# EAGLE design stm32_bob (EAGLE 7.3.0)
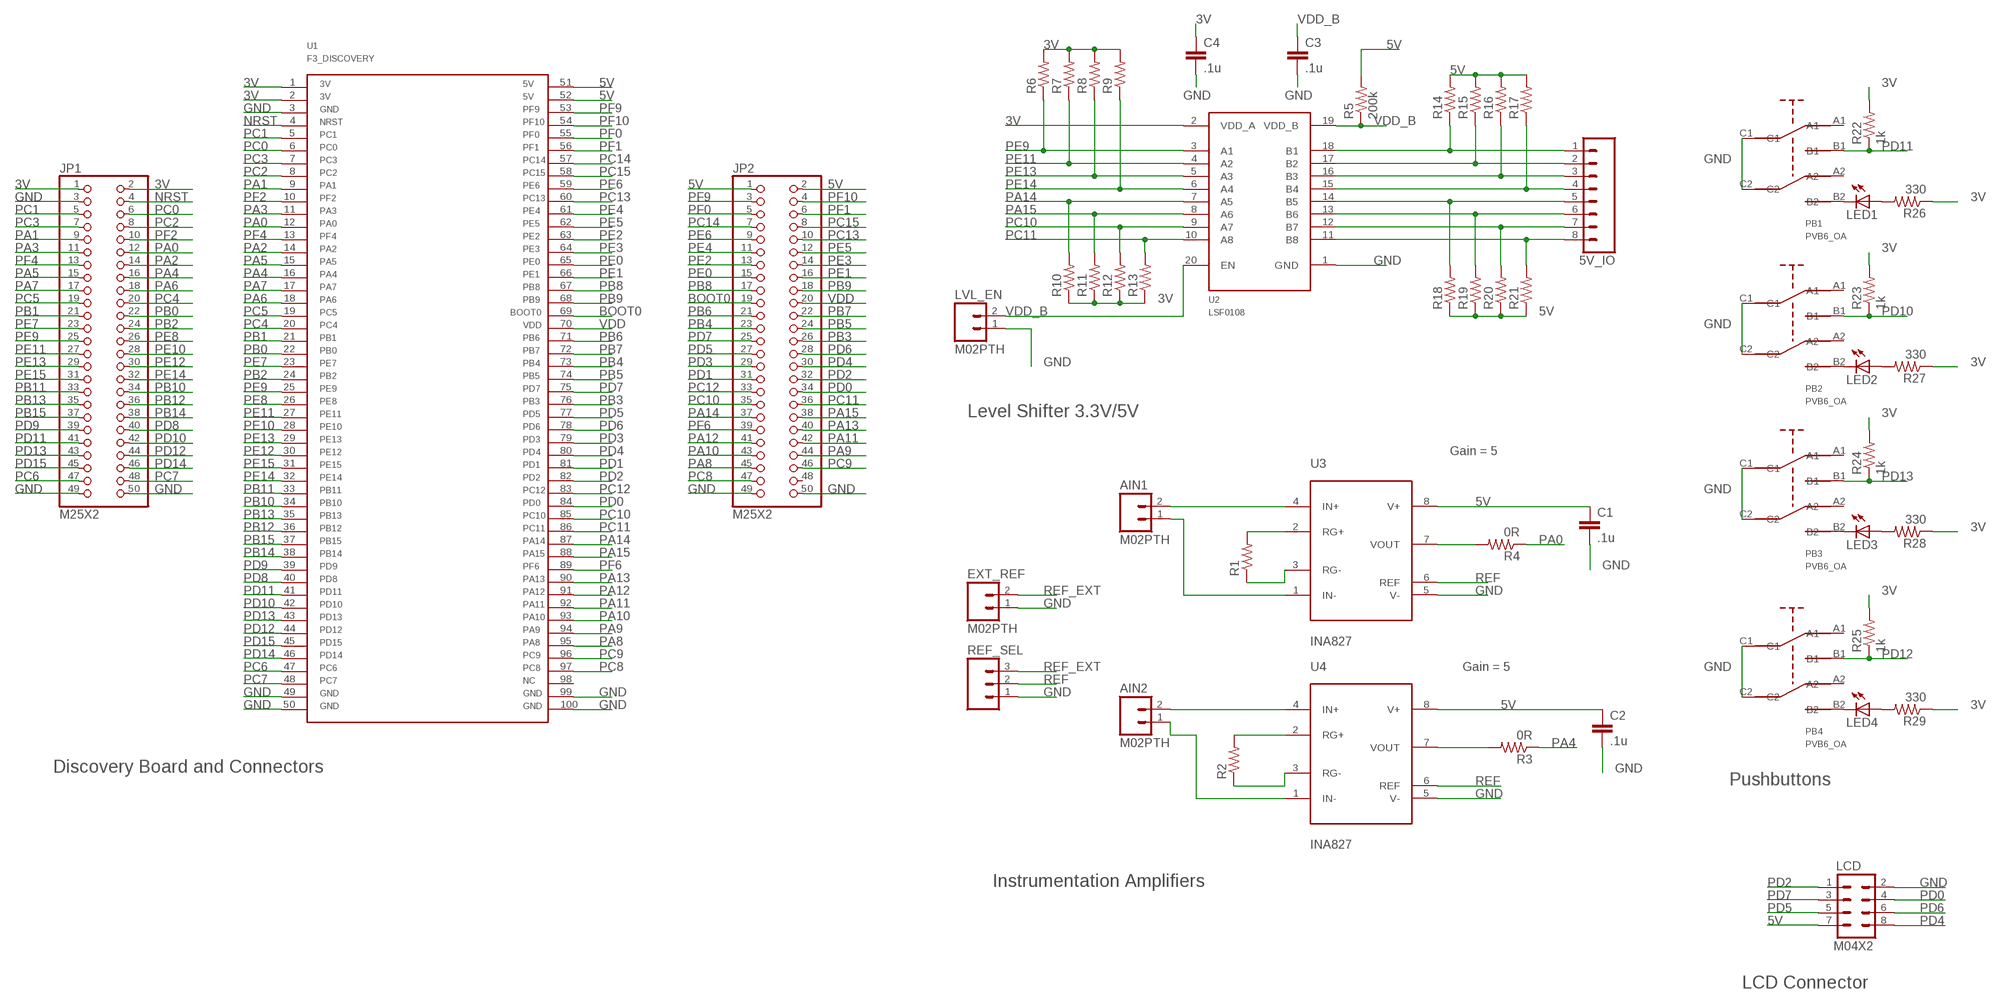
[diagram p0: schematic, sheet 1]

## Parts
5V_IO  M081X08  [1X08]
AIN1  M02PTH  [1X02]
AIN2  M02PTH  [1X02]
C1  .1u  C-EUC0805  [C0805]
C2  .1u  C-EUC0805  [C0805]
C3  .1u  C-EUC0805  [C0805]
C4  .1u  C-EUC0805  [C0805]
EXT_REF  M02PTH  [1X02]
JP1  M25X2  [2X25]
JP2  M25X2  [2X25]
LCD  M04X2  [2X4]
LED1  LED1206  [LED-1206]
LED2  LED1206  [LED-1206]
LED3  LED1206  [LED-1206]
LED4  LED1206  [LED-1206]
LVL_EN  M02PTH  [1X02]
PB1  PVB6_OA  [PVB6_OA]
PB2  PVB6_OA  [PVB6_OA]
PB3  PVB6_OA  [PVB6_OA]
PB4  PVB6_OA  [PVB6_OA]
R1  R-US_R1206  [R1206]
R2  R-US_R1206  [R1206]
R3  0R  R-US_R1206  [R1206]
R4  0R  R-US_R1206  [R1206]
R5  200k  R-US_R0805  [R0805]
R6  R-US_R0805  [R0805]
R7  R-US_R0805  [R0805]
R8  R-US_R0805  [R0805]
R9  R-US_R0805  [R0805]
R10  R-US_R0805  [R0805]
R11  R-US_R0805  [R0805]
R12  R-US_R0805  [R0805]
R13  R-US_R0805  [R0805]
R14  R-US_R0805  [R0805]
R15  R-US_R0805  [R0805]
R16  R-US_R0805  [R0805]
R17  R-US_R0805  [R0805]
R18  R-US_R0805  [R0805]
R19  R-US_R0805  [R0805]
R20  R-US_R0805  [R0805]
R21  R-US_R0805  [R0805]
R22  1k  R-US_R0805  [R0805]
R23  1k  R-US_R0805  [R0805]
R24  1k  R-US_R0805  [R0805]
R25  1k  R-US_R0805  [R0805]
R26  330  R-US_R0805  [R0805]
R27  330  R-US_R0805  [R0805]
R28  330  R-US_R0805  [R0805]
R29  330  R-US_R0805  [R0805]
REF_SEL  M03PTH  [1X03]
U1  F3_DISCOVERY  [F3_DISCOVERY]
U2  LSF0108  [LSF0108]
U3  INA827  [MSOP8]
U4  INA827  [MSOP8]

## Nets
3V: C4.1 JP1.1 JP1.2 R6.2 R7.2 R8.2 R9.2 R10.1 R11.1 R12.1 R13.1 R22.2 R23.2 R24.2 R25.2 R26.1 R27.1 R28.1 R29.1 U1.1 U1.2 U2.2(VDD_A)
5V: C1.1 C2.1 JP2.1 JP2.2 LCD.7 R5.2 R14.2 R15.2 R16.2 R17.2 R18.1 R19.1 R20.1 R21.1 U1.51 U1.52 U3.8(V+) U4.8(V+)
BOOT0: JP2.19 U1.69
GND: C1.2 C2.2 C3.2 C4.2 EXT_REF.1 JP1.3 JP1.49 JP1.50 JP2.49 JP2.50 LCD.2 LVL_EN.1 PB1.C1 PB1.C2 PB2.C1 PB2.C2 PB3.C1 PB3.C2 PB4.C1 PB4.C2 REF_SEL.1 U1.3 U1.49 U1.50 U1.99 U1.100 U2.1(GND) U3.5(V-) U4.5(V-)
N$1: 5V_IO.1 R14.1 U2.18(B1)
N$2: 5V_IO.2 R15.1 U2.17(B2)
N$3: 5V_IO.3 R16.1 U2.16(B3)
N$4: 5V_IO.4 R17.1 U2.15(B4)
N$5: 5V_IO.5 R18.2 U2.14(B5)
N$6: 5V_IO.6 R19.2 U2.13(B6)
N$7: 5V_IO.7 R20.2 U2.12(B7)
N$8: 5V_IO.8 R21.2 U2.11(B8)
N$9: AIN1.1 U3.1(IN-)
N$10: AIN1.2 U3.4(IN+)
N$11: AIN2.2 U4.4(IN+)
N$12: AIN2.1 U4.1(IN-)
N$13: R1.2 U3.2(RG+)
N$14: R1.1 U3.3(RG-)
N$15: R2.2 U4.2(RG+)
N$16: R2.1 U4.3(RG-)
N$17: R4.2 U3.7(VOUT)
N$18: R3.2 U4.7(VOUT)
N$19: LED1.C PB1.B2
N$20: LED2.C PB2.B2
N$21: LED3.C PB3.B2
N$22: LED4.C PB4.B2
N$23: LED1.A R26.2
N$24: LED2.A R27.2
N$25: LED3.A R28.2
N$26: LED4.A R29.2
NRST: JP1.4 U1.4
PA0: JP1.12 R4.1 U1.12
PA1: JP1.9 U1.9
PA2: JP1.14 U1.14
PA3: JP1.11 U1.11
PA4: JP1.16 R3.1 U1.16
PA5: JP1.15 U1.15
PA6: JP1.18 U1.18
PA7: JP1.17 U1.17
PA8: JP2.45 U1.95
PA9: JP2.44 U1.94
PA10: JP2.43 U1.93
PA11: JP2.42 U1.92
PA12: JP2.41 U1.91
PA13: JP2.40 U1.90
PA14: JP2.37 R10.2 U1.87 U2.7(A5)
PA15: JP2.38 R11.2 U1.88 U2.8(A6)
PB0: JP1.22 U1.22
PB1: JP1.21 U1.21
PB2: JP1.24 U1.24
PB3: JP2.26 U1.76
PB4: JP2.23 U1.73
PB5: JP2.24 U1.74
PB6: JP2.21 U1.71
PB7: JP2.22 U1.72
PB8: JP2.17 U1.67
PB9: JP2.18 U1.68
PB10: JP1.34 U1.34
PB11: JP1.33 U1.33
PB12: JP1.36 U1.36
PB13: JP1.35 U1.35
PB14: JP1.38 U1.38
PB15: JP1.37 U1.37
PC0: JP1.6 U1.6
PC1: JP1.5 U1.5
PC2: JP1.8 U1.8
PC3: JP1.7 U1.7
PC4: JP1.20 U1.20
PC5: JP1.19 U1.19
PC6: JP1.47 U1.47
PC7: JP1.48 U1.48
PC8: JP2.47 U1.97
PC9: JP2.46 U1.96
PC10: JP2.35 R12.2 U1.85 U2.9(A7)
PC11: JP2.36 R13.2 U1.86 U2.10(A8)
PC12: JP2.33 U1.83
PC13: JP2.10 U1.60
PC14: JP2.7 U1.57
PC15: JP2.8 U1.58
PD0: JP2.34 LCD.4 U1.84
PD1: JP2.31 U1.81
PD2: JP2.32 LCD.1 U1.82
PD3: JP2.29 U1.79
PD4: JP2.30 LCD.8 U1.80
PD5: JP2.27 LCD.5 U1.77
PD6: JP2.28 LCD.6 U1.78
PD7: JP2.25 LCD.3 U1.75
PD8: JP1.40 U1.40
PD9: JP1.39 U1.39
PD10: JP1.42 PB2.B1 R23.1 U1.42
PD11: JP1.41 PB1.B1 R22.1 U1.41
PD12: JP1.44 PB4.B1 R25.1 U1.44
PD13: JP1.43 PB3.B1 R24.1 U1.43
PD14: JP1.46 U1.46
PD15: JP1.45 U1.45
PE0: JP2.15 U1.65
PE1: JP2.16 U1.66
PE2: JP2.13 U1.63
PE3: JP2.14 U1.64
PE4: JP2.11 U1.61
PE5: JP2.12 U1.62
PE6: JP2.9 U1.59
PE7: JP1.23 U1.23
PE8: JP1.26 U1.26
PE9: JP1.25 R6.1 U1.25 U2.3(A1)
PE10: JP1.28 U1.28
PE11: JP1.27 R7.1 U1.27 U2.4(A2)
PE12: JP1.30 U1.30
PE13: JP1.29 R8.1 U1.29 U2.5(A3)
PE14: JP1.32 R9.1 U1.32 U2.6(A4)
PE15: JP1.31 U1.31
PF0: JP2.5 U1.55
PF1: JP2.6 U1.56
PF2: JP1.10 U1.10
PF4: JP1.13 U1.13
PF6: JP2.39 U1.89
PF9: JP2.3 U1.53
PF10: JP2.4 U1.54
REF: REF_SEL.2 U3.6(REF) U4.6(REF)
REF_EXT: EXT_REF.2 REF_SEL.3
VDD: JP2.20 U1.70
VDD_B: C3.1 LVL_EN.2 R5.1 U2.19(VDD_B) U2.20(EN)
Unconnected: JP2.48 PB1.A1 PB1.A2 PB2.A1 PB2.A2 PB3.A1 PB3.A2 PB4.A1 PB4.A2 U1.98

## Notes on the sheet
- Level Shifter 3.3V/5V
- Gain = 5
- Gain = 5
- Discovery Board and Connectors
- Pushbuttons
- Instrumentation Amplifiers
- LCD Connector

## Library data of the parts
5V_IO = SparkFun-Connectors:M08: Header 8 Standard 8-pin 0.1" header. Use with straight break away headers (SKU : PRT-00116), right angle break away headers (PRT-00553), swiss pins (PRT-00743), machine pins (PRT-00117), and female headers (PRT-00115).
AIN1 AIN2 EXT_REF LVL_EN = SparkFun-Connectors:M02: Standard 2-pin 0.1" header. Use with - straight break away headers ( PRT-00116) - right angle break away headers (PRT-00553) - swiss pins (PRT-00743) - machine pins (PRT-00117) - female headers (PRT-00115) Molex polarized connector foot print use with: PRT-08233 with associated crimp pins and housings. 2.54_SCREWTERM for use with PRT-10571. 3.5mm Screw Terminal footprints for PRT-08084 5mm Screw Terminal footprints for use with PRT-08433
C1-C4 = rcl:C-EU: CAPACITOR, European symbol
JP1 JP2 = SparkFun-Connectors:M25X2
LCD = SparkFun-Connectors:M04X2: .1" header, two rows of four.
LED1-LED4 = SparkFun-LED:LED: LEDs Standard schematic elements and footprints for 5mm, 3mm, 1206, and 0603 sized LEDs. 5mm - Spark Fun Electronics SKU : COM-00529 (and others)
PB1-PB4 = green-electronics:PVB6_OA
R1-R29 = rcl:R-US_: RESISTOR, American symbol
REF_SEL = SparkFun-Connectors:M03: Header 3 Standard 3-pin 0.1" header. Use with straight break away headers (SKU : PRT-00116), right angle break away headers (PRT-00553), swiss pins (PRT-00743), machine pins (PRT-00117), and female headers (PRT-00115). Molex polarized connector foot print use with SKU : PRT-08232 with associated crimp pins and housings.
U1 = green-electronics:F3_DISCOVERY
U2 = green-electronics:LSF0108
U3 U4 = littlebox:INA827

## Board
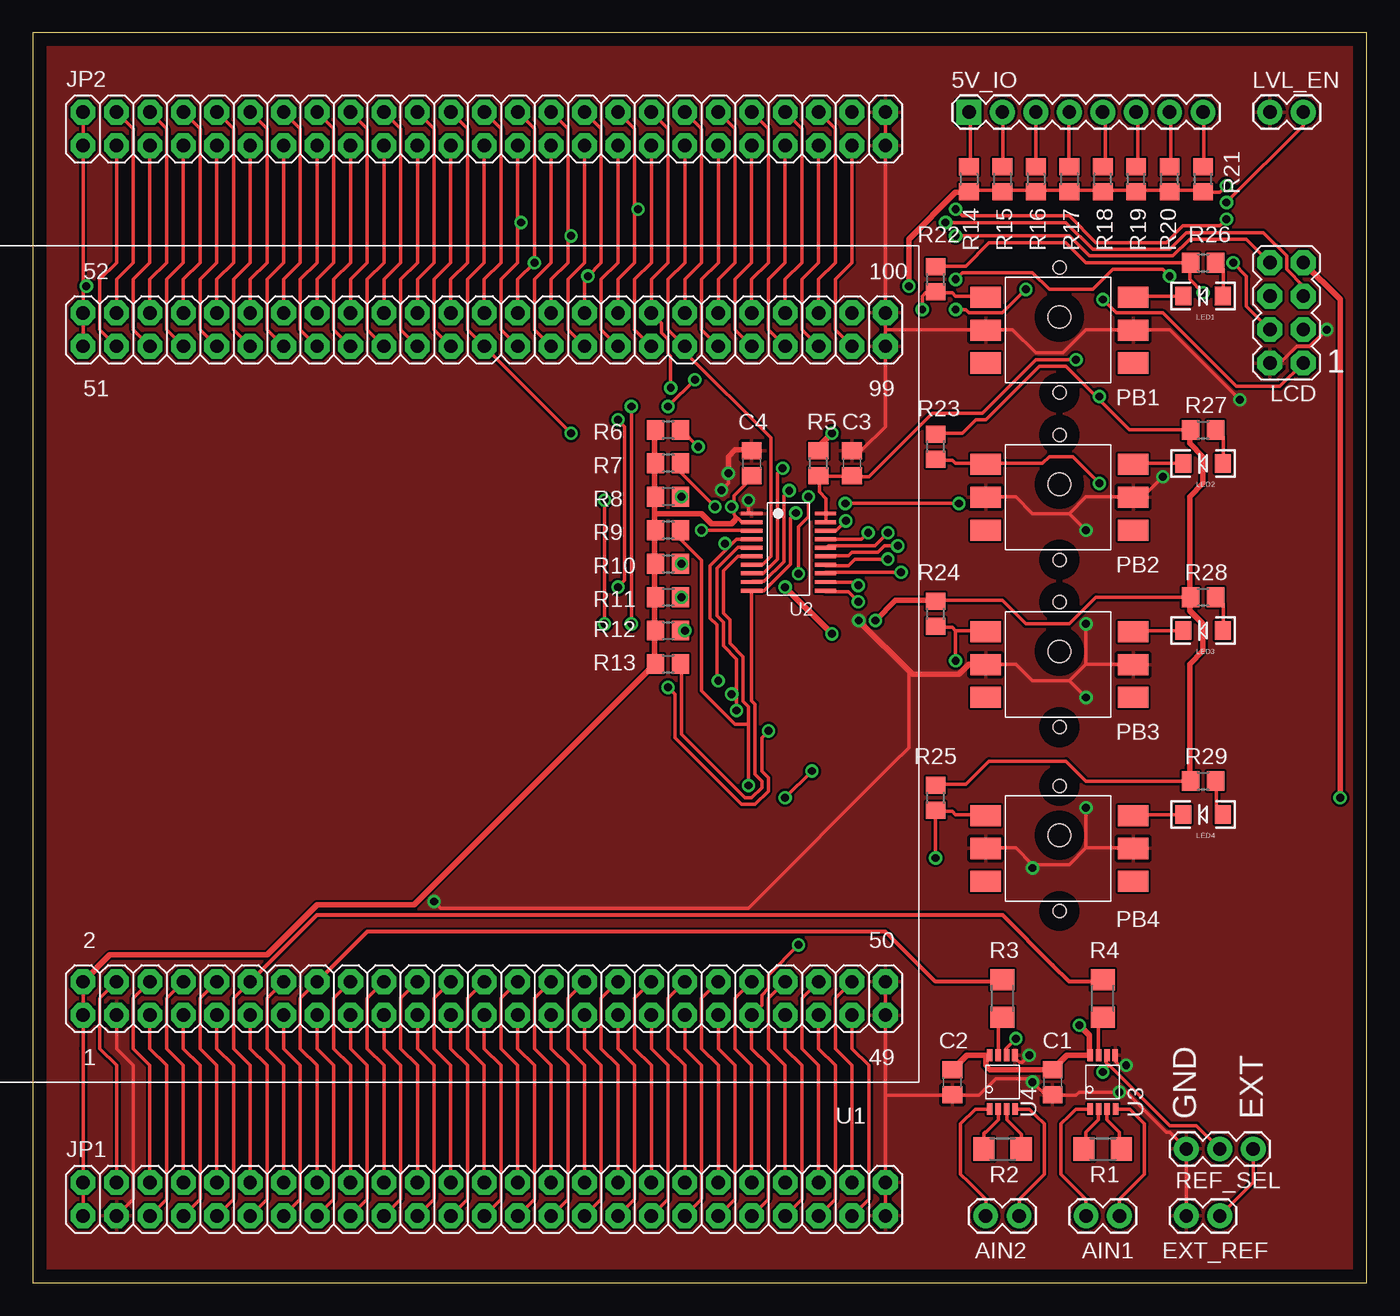
[diagram p1: board, top side]
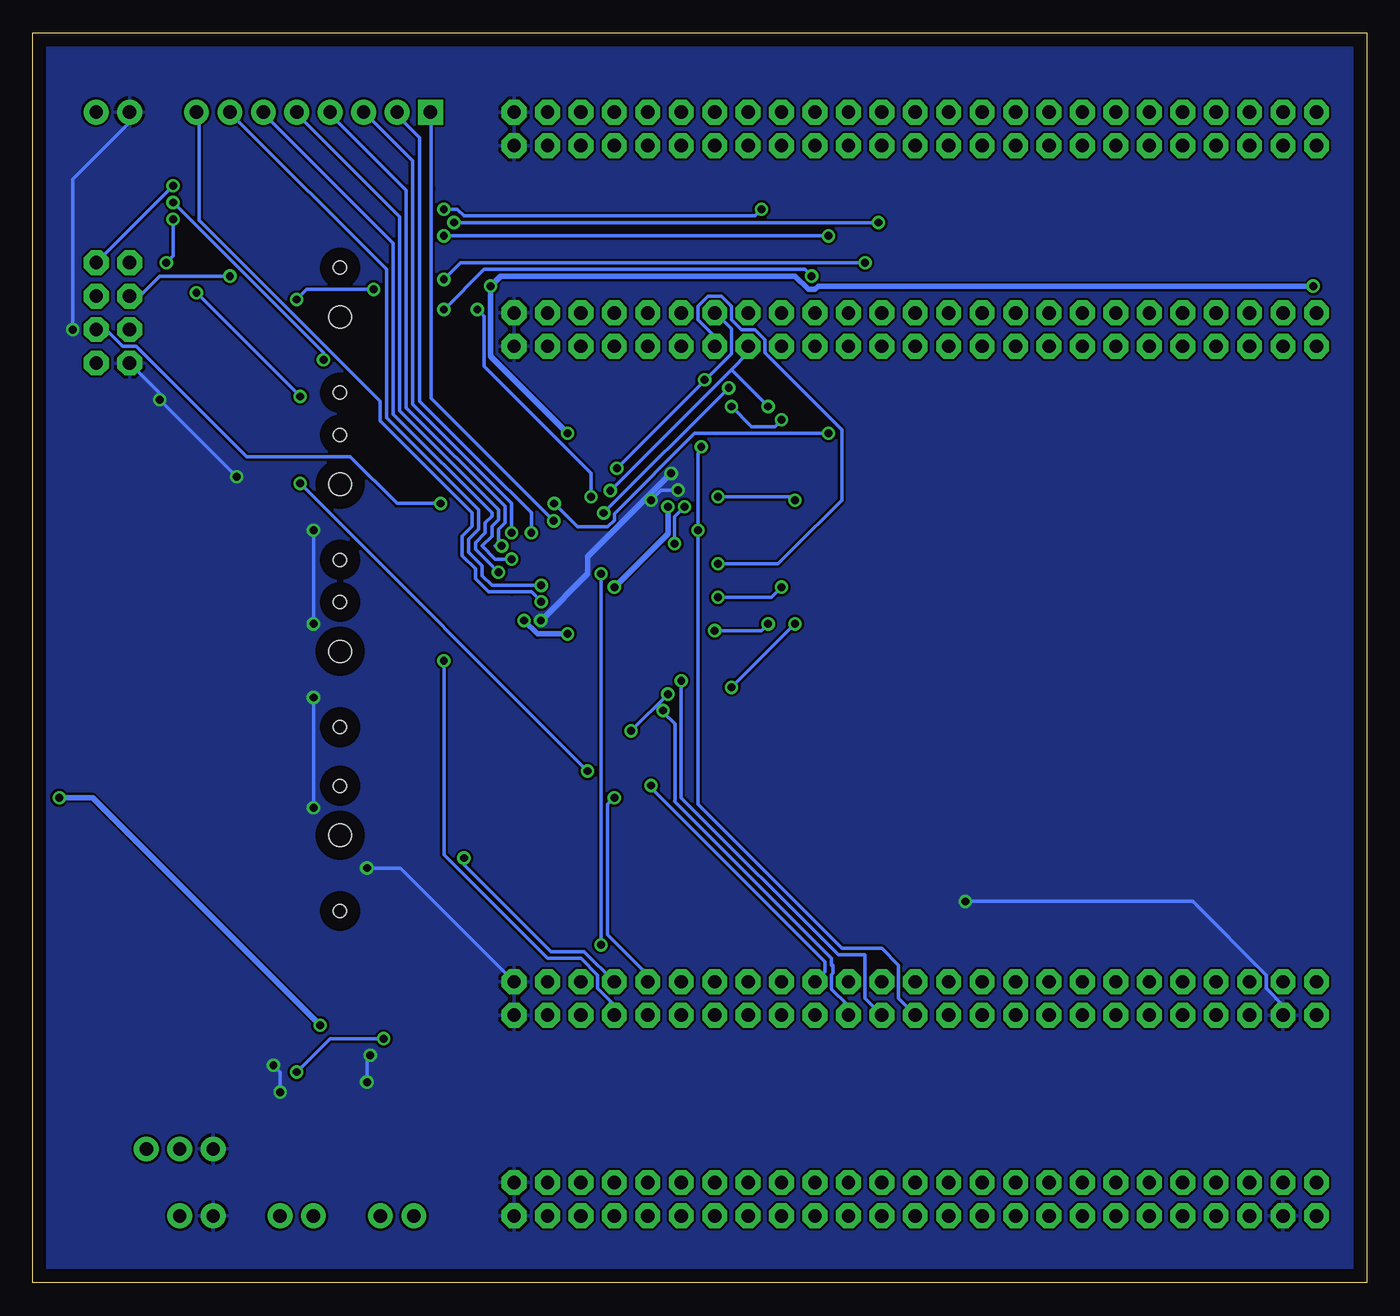
[diagram p2: board, bottom side, seen from below]

Size 101.33 x 94.92 mm. Coordinates in mm from the lower left corner, seen from the top.
Outline: 0,0 101.33,0 101.33,94.92 0,94.92 0,0
Copper layers (1*16): Top 0.035mm / dielectric 1.5mm / Bottom 0.035mm
Design rules "default *": minimum track width 10mil, minimum drill 10mil, track to track 7mil, track to pad 7mil, pad to pad 7mil, via to via 7mil, smd to smd 0mil, copper to edge 40mil, drill to drill 8mil, minimum pad ring 10mil, minimum via ring 8mil, stop-mask expansion 4mil, vias tented up to drill 0mil, thermal gap 10mil

### Footprints (pad centres in the part's own frame; a part is rotated, then mirrored left to right if it is on the bottom)
1X08 = drill 1.016 pad 1.88 square: 1 0,0 | drill 1.016 pad 1.88: 2 2.54,0; 3 5.08,0; 4 7.62,0; 5 10.16,0; 6 12.7,0; 7 15.24,0; 8 17.78,0
1X02 = drill 1.016 pad 1.88: 1 0,0; 2 2.54,0
C0805 = smd 1.3 x 1.5: 1 -0.95,0; 2 0.95,0
2X25 = drill 1.016 pad 1.88 octagon: 1 0,0; 2 0,2.54; 3 2.54,0; 4 2.54,2.54; 5 5.08,0; 6 5.08,2.54; 7 7.62,0; 8 7.62,2.54; 9 10.16,0; 10 10.16,2.54; 11 12.7,0; 12 12.7,2.54; 13 15.24,0; 14 15.24,2.54; 15 17.78,0; 16 17.78,2.54; 17 20.32,0; 18 20.32,2.54; 19 22.86,0; 20 22.86,2.54; 21 25.4,0; 22 25.4,2.54; 23 27.94,0; 24 27.94,2.54; 25 30.48,0; 26 30.48,2.54; 27 33.02,0; 28 33.02,2.54; 29 35.56,0; 30 35.56,2.54; 31 38.1,0; 32 38.1,2.54; 33 40.64,0; 34 40.64,2.54; 35 43.18,0; 36 43.18,2.54; 37 45.72,0; 38 45.72,2.54; 39 48.26,0; 40 48.26,2.54; 41 50.8,0; 42 50.8,2.54; 43 53.34,0; 44 53.34,2.54; 45 55.88,0; 46 55.88,2.54; 47 58.42,0; 48 58.42,2.54; 49 60.96,0; 50 60.96,2.54
2X4 = drill 1.016 pad 1.88 octagon: 1 -3.81,-1.27; 2 -3.81,1.27; 3 -1.27,-1.27; 4 -1.27,1.27; 5 1.27,-1.27; 6 1.27,1.27; 7 3.81,-1.27; 8 3.81,1.27
LED-1206 = smd 1.2 x 1.4: A -1.5,0; C 1.5,0
PVB6_OA = smd 2.3 x 1.6: A1 0,0; A2 11.2,0; B1 0,5; B2 11.2,5; C1 0,2.5; C2 11.2,2.5 | hole 1: 5.6,7.25; 5.6,-2.25 | hole 1.7: 5.6,3.5
R1206 = smd 1.6 x 1.803: 1 -1.422,0; 2 1.422,0
R0805 = smd 1.3 x 1.5: 1 -0.95,0; 2 0.95,0
1X03 = drill 1.016 pad 1.88: 1 0,0; 2 2.54,0; 3 5.08,0
F3_DISCOVERY = drill 1.016 pad 1.88 octagon: 1 0,0; 2 0,2.54; 3 2.54,0; 4 2.54,2.54; 5 5.08,0; 6 5.08,2.54; 7 7.62,0; 8 7.62,2.54; 9 10.16,0; 10 10.16,2.54; 11 12.7,0; 12 12.7,2.54; 13 15.24,0; 14 15.24,2.54; 15 17.78,0; 16 17.78,2.54; 17 20.32,0; 18 20.32,2.54; 19 22.86,0; 20 22.86,2.54; 21 25.4,0; 22 25.4,2.54; 23 27.94,0; 24 27.94,2.54; 25 30.48,0; 26 30.48,2.54; 27 33.02,0; 28 33.02,2.54; 29 35.56,0; 30 35.56,2.54; 31 38.1,0; 32 38.1,2.54; 33 40.64,0; 34 40.64,2.54; 35 43.18,0; 36 43.18,2.54; 37 45.72,0; 38 45.72,2.54; 39 48.26,0; 40 48.26,2.54; 41 50.8,0; 42 50.8,2.54; 43 53.34,0; 44 53.34,2.54; 45 55.88,0; 46 55.88,2.54; 47 58.42,0; 48 58.42,2.54; 49 60.96,0; 50 60.96,2.54; 51 0,50.8; 52 0,53.34; 53 2.54,50.8; 54 2.54,53.34; 55 5.08,50.8; 56 5.08,53.34; 57 7.62,50.8; 58 7.62,53.34; 59 10.16,50.8; 60 10.16,53.34; 61 12.7,50.8; 62 12.7,53.34; 63 15.24,50.8; 64 15.24,53.34; 65 17.78,50.8; 66 17.78,53.34; 67 20.32,50.8; 68 20.32,53.34; 69 22.86,50.8; 70 22.86,53.34; 71 25.4,50.8; 72 25.4,53.34; 73 27.94,50.8; 74 27.94,53.34; 75 30.48,50.8; 76 30.48,53.34; 77 33.02,50.8; 78 33.02,53.34; 79 35.56,50.8; 80 35.56,53.34; 81 38.1,50.8; 82 38.1,53.34; 83 40.64,50.8; 84 40.64,53.34; 85 43.18,50.8; 86 43.18,53.34; 87 45.72,50.8; 88 45.72,53.34; 89 48.26,50.8; 90 48.26,53.34; 91 50.8,50.8; 92 50.8,53.34; 93 53.34,50.8; 94 53.34,53.34; 95 55.88,50.8; 96 55.88,53.34; 97 58.42,50.8; 98 58.42,53.34; 99 60.96,50.8; 100 60.96,53.34
LSF0108 = smd 0.3 x 1.6: 1 0,0; 2 0.65,0; 3 1.3,0; 4 1.95,0; 5 2.6,0; 6 3.25,0; 7 3.9,0; 8 4.55,0; 9 5.2,0; 10 5.85,0; 11 5.85,5.6; 12 5.2,5.6; 13 4.55,5.6; 14 3.9,5.6; 15 3.25,5.6; 16 2.6,5.6; 17 1.95,5.6; 18 1.3,5.6; 19 0.65,5.6; 20 0,5.6
MSOP8 = smd 0.9 x 0.42: 1 -2.05,0.975; 2 -2.05,0.325; 3 -2.05,-0.325; 4 -2.05,-0.975; 5 2.05,-0.945; 6 2.05,-0.325; 7 2.05,0.325; 8 2.05,0.975

### Placement (x,y rotation side)
5V_IO  71.12,88.9 0 top
AIN1  80.01,5.08 0 top
AIN2  72.39,5.08 0 top
C1  77.47,15.24 270 top
C2  69.85,15.24 270 top
C3  62.23,62.23 90 top
C4  54.61,62.23 90 top
EXT_REF  87.63,5.08 0 top
JP1  3.81,5.08 0 top
JP2  3.81,86.36 0 top
LCD  95.25,73.66 90 top
LED1  88.9,74.93 180 top
LED2  88.9,62.23 180 top
LED3  88.9,49.53 180 top
LED4  88.9,35.56 180 top
LVL_EN  93.98,88.9 0 top
PB1  72.39,69.85 0 top
PB2  72.39,57.15 0 top
PB3  72.39,44.45 0 top
PB4  72.39,30.48 0 top
R1  81.28,10.16 180 top
R2  73.66,10.16 180 top
R3  73.66,21.59 270 top
R4  81.28,21.59 270 top
R5  59.69,62.23 90 top
R6  48.26,64.77 180 top
R7  48.26,62.23 180 top
R8  48.26,59.69 180 top
R9  48.26,57.15 180 top
R10  48.26,54.61 0 top
R11  48.26,52.07 0 top
R12  48.26,49.53 0 top
R13  48.26,46.99 0 top
R14  71.12,83.82 270 top
R15  73.66,83.82 270 top
R16  76.2,83.82 270 top
R17  78.74,83.82 270 top
R18  81.28,83.82 90 top
R19  83.82,83.82 90 top
R20  86.36,83.82 90 top
R21  88.9,83.82 90 top
R22  68.58,76.2 90 top
R23  68.58,63.5 90 top
R24  68.58,50.8 90 top
R25  68.58,36.83 90 top
R26  88.9,77.47 0 top
R27  88.9,64.77 0 top
R28  88.9,52.07 0 top
R29  88.9,38.1 0 top
REF_SEL  87.63,10.16 0 top
U1  3.81,20.32 0 top
U2  54.61,58.42 270 top
U3  81.28,15.24 90 top
U4  73.66,15.24 90 top

### Tracks (layer width: path | path; a pad name or v marks a point on that pad's centre or on a via)
3V  (via drill 0.6)
  Top 0.254: U1.2 U1.1 3.81,17.78 JP1.2 JP1.1 | 53.4,58.22 53.26,58.36 53.26,58.93 53.26,59.76 54.76,61.26 54.66,61.36 C4.1 | 53.4,58.22 53.65,57.97 53.86,57.76 54.56,57.76 U2.2 | 87.88,77.47 80.01,77.47 78.49,78.99 72.64,78.99 70.87,77.22 68.58,77.22 R22.2 | 87.88,77.47 R26.1 87.88,77.47 | 80.77,67.31 78.49,69.6 76.45,69.6 72.39,65.53 71.63,65.53 70.61,64.52 68.58,64.52 R23.2 | 80.77,67.31 83.31,64.77 87.88,64.77 R27.1 | R28.1 87.88,52.07 80.77,52.07 78.74,50.04 75.44,50.04 73.66,51.82 68.58,51.82 R24.2 | R29.1 87.88,38.1 80.01,38.1 78.49,39.62 72.64,39.62 70.87,37.85 68.58,37.85 R25.2 | 53.34,57.91 53.34,58.17 53.4,58.22 | v81.03,67.31 80.77,67.31 | v88.9,75.18 87.88,76.2 87.88,77.47
  Top 0.406: U1.2 5.84,24.89 17.78,24.89 21.59,28.7 26.42,28.7 28.96,28.7 47.24,46.99 | 47.24,46.99 R13.1 | 47.24,46.99 47.24,49.53 | 47.24,49.53 R12.1 47.24,49.53 | 47.24,46.99 R13.1 | 47.24,49.53 47.24,52.07 | 47.24,52.07 R11.1 47.24,52.07 | 47.24,52.07 47.24,54.61 | 47.24,54.61 R10.1 47.24,54.61 | 47.24,54.61 47.24,57.15 | 47.24,57.15 R9.2 47.24,57.15 | 47.24,57.15 47.24,58.42 | 47.24,58.42 47.24,59.69 | 47.24,59.69 R8.2 47.24,59.69 | 47.24,59.69 47.24,62.23 | 47.24,62.23 R7.2 47.24,62.23 | 47.24,62.23 47.24,64.77 R6.2 | 53.34,57.91 53.09,57.66 51.56,57.66 50.8,58.42 47.24,58.42 | 87.88,52.07 87.88,59.69 88.9,60.71 88.9,62.74 87.88,63.75 87.88,64.77 R27.1 | 87.88,52.07 R28.1 87.88,52.07 | 87.88,52.07 87.88,51.05 88.9,50.04 88.9,48.01 87.88,46.99 87.88,39.12 87.88,38.1 R29.1 | v64.01,50.29 65.53,51.82 68.58,51.82 R24.2 | v57.15,52.83 v60.71,49.28 | 53.26,58.93 53.34,58.93 53.26,58.93 | 53.26,58.93 v53.09,58.93 | 47.24,46.99 R13.1
  Bottom 0.254: v88.9,75.18 v81.03,67.31
  Bottom 0.406: v64.01,50.29 62.99,49.28 v60.71,49.28 | v57.15,52.83 53.09,56.9 v53.09,58.93
5V  (via drill 0.6)
  Top 0.254: U1.51 U1.52 3.81,75.69 JP2.1 JP2.2 | R14.2 71.21,82.96 73.46,82.96 R15.2 73.71,82.96 75.96,82.96 R16.2 76.21,82.96 78.71,82.96 R17.2 78.96,82.96 81.21,82.96 R18.1 81.46,82.96 83.71,82.96 R19.1 83.96,82.96 86.21,82.96 R20.1 86.46,82.96 88.71,82.96 R21.1 88.9,82.8 90.17,82.8 v90.68,83.31
  Top 0.406: C2.1 70.95,17.29 U4.8 72.39,17 72.39,16.51 72.71,16.19 C1.1 78.57,17.29 U3.8 80.26,17.53 80.26,18.8 v79.5,19.56 | v66.55,75.69 66.55,79.25 70.1,82.8 71.12,82.8 R14.2 | v60.71,64.52 59.44,63.25 59.69,62.99 R5.2 | v4.06,75.69 3.81,75.69 | v99.31,36.83 99.31,74.68 LCD.7
  Bottom 0.254: LCD.7 v90.68,83.31
  Bottom 0.406: v60.71,64.52 66.55,70.36 v66.55,75.69 65.79,76.45 43.43,76.45 42.42,75.44 41.91,75.44 41.66,75.69 v4.06,75.69 | v99.31,36.83 96.77,36.83 v79.5,19.56
BOOT0
  Top 0.254: JP2.19 26.67,77.47 25.4,76.2 25.4,72.39 U1.69
GND  (via drill 0.6)
  Top 0.254: U1.3 6.35,17.78 7.62,16.51 7.62,6.35 JP1.3 | U1.50 64.77,21.59 U1.49 64.77,19.05 64.77,14.22 | 64.77,14.22 JP1.50 JP1.49 | JP2.50 JP2.49 U1.100 64.77,72.39 | 64.77,72.39 U1.99 64.77,65.02 62.99,63.25 62.23,63.25 C3.2 | 80.01,33.02 83.57,33.02 PB4.C2 | 80.01,33.02 78.74,31.75 75.95,31.75 | 75.95,31.75 74.68,33.02 72.39,33.02 PB4.C1 | 80.01,46.99 83.57,46.99 PB3.C2 | 78.74,45.72 80.01,46.99 | 78.74,45.72 75.95,45.72 74.68,46.99 72.39,46.99 PB3.C1 | 78.74,58.42 80.01,59.69 83.57,59.69 PB2.C2 83.82,59.69 84.33,59.69 v85.85,61.21 | 78.74,58.42 75.95,58.42 74.68,59.69 72.39,59.69 PB2.C1 | 72.39,72.39 74.42,72.39 76.2,70.61 78.23,70.61 80.01,72.39 83.57,72.39 PB1.C2 83.82,72.39 86.36,72.39 v91.69,67.06 | 72.39,72.39 PB1.C1 72.39,72.39 | EXT_REF.1 REF_SEL.1 86.36,11.43 86.11,11.43 83.06,14.48 v82.55,14.48 79.5,14.48 79.25,14.22 77.47,14.22 | 77.47,14.22 C1.2 77.47,14.22 | 77.47,14.22 76.96,14.22 v75.95,15.24 75.69,15.49 73.15,15.49 71.88,14.22 69.85,14.22 | v75.69,17.27 75.18,16.76 74.93,16.76 74.68,17.02 74.68,17.27 U4.5 | v83.06,16.51 82.55,16.51 82.3,16.76 82.3,17.27 U3.5 | 69.85,14.22 C2.2 69.85,14.22 | 69.85,14.22 64.77,14.22 | LCD.2 94.74,69.85 96.01,71.12 97.03,71.12 v98.3,72.39 | 72.39,72.39 64.77,72.39 | v80.01,50.04 80.01,46.99 | 78.74,58.42 v80.01,57.15 | v80.01,36.07 80.01,33.02 | 78.74,45.72 v80.01,44.45 | v75.95,31.5 75.95,31.75 | v30.48,28.96 30.99,28.45 51.82,28.45 54.36,28.45 65.28,39.37 66.55,40.64 66.55,46.23 66.67,46.35 | v52.83,61.47 52.83,60.71 v52.32,60.2 | v54.36,59.44 54.36,58.42 U2.1
  Top 0.406: v62.74,50.29 66.67,46.35 66.8,46.23 70.36,46.23 71.12,46.99 72.39,46.99 PB3.C1 | v52.83,61.47 52.83,62.74 53.34,63.25 54.61,63.25 C4.2
  Bottom 0.254: v75.95,15.24 75.95,17.02 v75.69,17.27 | v82.55,14.48 82.55,16 v83.06,16.51 | LCD.2 91.69,67.56 v91.69,67.06 v85.85,61.21 | v98.3,72.39 98.3,83.82 93.98,88.14 LVL_EN.1 | v80.01,57.15 v80.01,50.04 | v80.01,44.45 v80.01,36.07 | v30.48,28.96 13.21,28.96 7.62,23.37 7.62,22.35 6.35,21.08 U1.3 | v52.32,60.2 53.59,60.2 v54.36,59.44 | v75.95,31.5 73.41,31.5 U1.50
  Bottom 0.406: v62.74,50.29 59.18,53.85 59.18,55.12 v52.83,61.47
  pour Top: 101.6,94.74 101.6,-0.25 0,-0.25 0.25,94.74
  pour Bottom: 0.25,95.25 101.85,95.25 101.85,0.25 0.25,0.25
N$1  (via drill 0.6)
  Top 0.254: v61.76,57.86 61.06,57.16 60.26,57.16 U2.18 | 5V_IO.1 71.21,88.71 71.21,84.96 R14.1
  Bottom 0.254: v61.76,57.86 71.06,67.16 71.06,83.06 71.06,83.16 71.06,88.86 5V_IO.1
N$2  (via drill 0.6)
  Top 0.254: v63.46,56.96 62.96,56.46 60.46,56.46 U2.17 | 5V_IO.2 73.71,88.71 73.71,84.96 R15.1
  Bottom 0.254: v63.46,56.96 63.46,58.46 66.96,61.96 71.96,66.96 71.96,86.96 73.46,88.46 5V_IO.2
N$3  (via drill 0.6)
  Top 0.254: v64.96,56.96 63.96,55.96 60.46,55.96 U2.16 | 5V_IO.3 76.21,88.71 76.21,84.96 R16.1
  Bottom 0.254: v64.96,56.96 64.96,58.96 64.96,59.21 72.46,66.71 72.46,85.21 75.96,88.71 5V_IO.3
N$4  (via drill 0.6)
  Top 0.254: v65.71,55.96 64.71,55.96 64.21,55.46 62.21,55.46 61.96,55.21 60.21,55.21 U2.15 | 5V_IO.4 78.71,88.71 78.71,84.96 R17.1
  Bottom 0.254: 65.96,55.96 v65.71,55.96 65.96,55.96 | 65.96,55.96 66.21,55.96 | 65.96,55.96 65.96,57.21 65.46,57.71 65.46,58.96 72.96,66.46 72.96,82.96 78.71,88.71 5V_IO.4
N$5  (via drill 0.6)
  Top 0.254: v64.96,54.96 62.46,54.96 61.96,54.46 60.21,54.46 U2.14 | 5V_IO.5 81.46,88.71 81.46,84.96 R18.2
  Bottom 0.254: v64.96,54.96 66.21,54.96 67.21,55.96 66.46,56.71 66.46,57.46 65.96,57.96 65.96,58.71 73.46,66.21 73.46,80.96 81.21,88.71 5V_IO.5
N$6  (via drill 0.6)
  Top 0.254: v65.96,53.96 60.21,53.96 U2.13 | 5V_IO.6 83.96,88.71 83.96,84.96 R19.2
  Bottom 0.254: v65.96,53.96 67.71,55.71 67.71,56.21 66.96,56.96 66.96,57.71 66.46,58.21 66.46,58.46 73.96,65.96 73.96,78.96 83.71,88.71 5V_IO.6
N$7  (via drill 0.6)
  Top 0.254: v62.71,52.96 62.46,53.21 U2.12 | 5V_IO.7 86.46,88.71 86.46,84.96 R20.2
  Bottom 0.254: v62.71,52.96 66.46,52.96 67.21,53.71 67.21,54.46 68.21,55.46 68.21,56.46 67.46,57.21 67.46,58.71 74.46,65.71 74.46,76.96 86.21,88.71 5V_IO.7
N$8  (via drill 0.6)
  Top 0.254: v62.71,51.71 61.96,52.46 60.21,52.46 U2.11 | 5V_IO.8 88.96,88.71 88.96,84.96 R21.2
  Bottom 0.254: v62.71,51.71 63.46,52.46 64.96,52.46 66.71,52.46 67.71,53.46 67.71,54.21 68.71,55.21 68.71,56.71 67.96,57.46 67.96,58.46 74.96,65.46 74.96,66.96 88.71,80.71 88.71,88.71 5V_IO.8
N$9
  Top 0.254: U3.1 79.23,13.19 78.74,12.7 78.11,12.06 78.11,8.26 80.01,6.35 AIN1.1
N$10
  Top 0.254: AIN1.2 82.55,6.35 84.45,8.26 84.45,12.06 83.33,13.19 U3.4
N$11
  Top 0.254: AIN2.2 74.93,6.35 76.83,8.26 76.83,12.06 76.2,12.7 75.71,13.19 U4.4
N$12
  Top 0.254: U4.1 71.61,13.19 70.48,12.06 70.48,8.26 71.12,7.62 72.39,6.35 AIN2.1
N$13
  Top 0.254: R1.2 80.01,10.31 80.01,11.43 80.95,12.38 U3.2
N$14
  Top 0.254: R1.1 82.55,10.31 82.55,11.43 81.61,12.38 U3.3
N$15
  Top 0.254: R2.2 72.24,11.28 arc-90 72.39,11.43 73.33,12.38 U4.2
N$16
  Top 0.254: R2.1 75.08,11.28 74.93,11.43 73.98,12.38 U4.3
N$17
  Top 0.254: U3.7 80.95,19.84 R4.2
N$18
  Top 0.254: U4.7 73.33,19.84 R3.2
N$19
  Top 0.254: LED1.C 87.38,74.93 83.82,74.93 PB1.B2
N$20
  Top 0.254: LED2.C 87.38,62.23 83.82,62.23 PB2.B2
N$21
  Top 0.254: LED3.C 87.38,49.53 83.82,49.53 PB3.B2
N$22
  Top 0.254: LED4.C 87.38,35.56 83.82,35.56 PB4.B2
N$23
  Top 0.254: R26.2 89.92,77.47 90.42,76.96 90.42,74.93 LED1.A
N$24
  Top 0.254: R27.2 89.92,64.77 90.42,64.26 90.42,62.23 LED2.A
N$25
  Top 0.254: R28.2 89.92,52.07 90.42,51.56 90.42,49.53 LED3.A
N$26
  Top 0.254: LED4.A 90.17,35.56 89.92,35.81 89.92,38.1 R29.2
NRST
  Top 0.254: U1.4 5.08,21.59 5.08,17.78 6.35,16.51 6.35,8.89 JP1.4
PA0
  Top 0.254: U1.12 15.24,21.59 15.24,17.78 16.51,16.51 JP1.12
  Top 0.305: U1.12 20.32,26.67 21.59,27.94 73.66,27.94 77.47,24.13 78.74,22.86 81.28,22.86 R4.1
PA1
  Top 0.254: U1.9 13.97,17.78 15.24,16.51 15.24,6.35 JP1.9
PA2
  Top 0.254: U1.14 17.78,21.59 17.78,17.78 19.05,16.51 JP1.14
PA3
  Top 0.254: U1.11 16.51,17.78 17.78,16.51 17.78,6.35 JP1.11
PA4
  Top 0.254: JP1.16 21.59,16.51 20.32,17.78 20.32,21.59 U1.16
  Top 0.305: R3.1 73.66,22.86 71.12,22.86 68.58,22.86 64.77,26.67 25.4,26.67 U1.16
PA5
  Top 0.254: U1.15 21.59,17.78 22.86,16.51 22.86,6.35 JP1.15
PA6
  Top 0.254: U1.18 22.86,21.59 22.86,17.78 24.13,16.51 JP1.18
PA7
  Top 0.254: U1.17 24.13,17.78 25.4,16.51 25.4,6.35 JP1.17
PA8
  Top 0.254: JP2.45 59.69,77.47 58.42,76.2 58.42,72.39 U1.95
PA9
  Top 0.254: U1.94 57.15,76.2 58.42,77.47 58.42,87.63 JP2.44
PA10
  Top 0.254: JP2.43 57.15,77.47 55.88,76.2 55.88,72.39 U1.93
PA11
  Top 0.254: U1.92 54.61,76.2 55.88,77.47 55.88,87.63 JP2.42
PA12
  Top 0.254: JP2.41 54.61,77.47 53.34,76.2 53.34,72.39 U1.91
PA13
  Top 0.254: U1.90 52.07,76.2 53.34,77.47 53.34,87.63 JP2.40
PA14  (via drill 0.6)
  Top 0.254: JP2.37 49.53,77.47 48.26,76.2 48.26,72.39 U1.87 49.56,71.06 49.56,70.66 56.06,64.16 56.06,55.16 55.46,54.56 54.66,54.56 U2.7 | R10.2 v49.28,54.61
  Bottom 0.254: v49.28,54.61 44.7,54.61 43.69,55.63 39.88,59.44 39.88,64.77 45.72,70.61 45.72,71.63 46.48,72.39 47.5,72.39 48.26,73.15 48.26,74.17 49.02,74.93 50.04,74.93 50.8,74.17 50.8,73.15 49.53,71.88 U1.87
PA15  (via drill 0.6)
  Top 0.254: U1.88 49.53,76.2 50.8,77.47 50.8,87.63 JP2.38 | v56.96,61.86 56.56,61.46 56.56,54.96 55.46,53.86 54.66,53.86 U2.8 | R11.2 v49.28,52.07 | v48.26,66.55 v50.29,68.58 | v44.45,65.53 44.96,65.02 44.96,53.34 v44.45,52.83
  Bottom 0.254: 50.27,68.55 48.26,70.56 48.26,72.46 49.46,73.66 U1.88 | 50.27,68.55 v56.96,61.86 | v49.28,52.07 45.21,52.07 v44.45,52.83 | v48.26,66.55 46.74,65.02 44.96,65.02 v44.45,65.53 | v50.29,68.58 50.27,68.55
PB0
  Top 0.254: JP1.22 29.21,16.51 27.94,17.78 27.94,21.59 U1.22
PB1
  Top 0.254: U1.21 29.21,17.78 30.48,16.51 30.48,6.35 JP1.21
PB2
  Top 0.254: U1.24 30.48,21.59 30.48,17.78 31.75,16.51 JP1.24
PB3
  Top 0.254: U1.76 34.29,76.2 35.56,77.47 35.56,87.63 JP2.26
PB4
  Top 0.254: JP2.23 31.75,77.47 30.48,76.2 30.48,72.39 U1.73
PB5
  Top 0.254: U1.74 31.75,76.2 33.02,77.47 33.02,87.63 JP2.24
PB6
  Top 0.254: JP2.21 29.21,77.47 27.94,76.2 27.94,72.39 U1.71
PB7
  Top 0.254: U1.72 29.21,76.2 30.48,77.47 30.48,87.63 JP2.22
PB8
  Top 0.254: JP2.17 24.13,77.47 22.86,76.2 22.86,72.39 U1.67
PB9
  Top 0.254: U1.68 24.13,76.2 25.4,77.47 25.4,87.63 JP2.18
PB10
  Top 0.254: U1.34 43.18,21.59 43.18,17.78 44.45,16.51 JP1.34
PB11
  Top 0.254: U1.33 44.45,17.78 45.72,16.51 45.72,6.35 JP1.33
PB12
  Top 0.254: U1.36 45.72,21.59 45.72,17.78 46.99,16.51 JP1.36
PB13
  Top 0.254: U1.35 46.99,17.78 48.26,16.51 48.26,6.35 JP1.35
PB14
  Top 0.254: U1.38 48.26,21.59 48.26,17.78 49.53,16.51 JP1.38
PB15
  Top 0.254: U1.37 49.53,17.78 50.8,16.51 50.8,6.35 JP1.37
PC0
  Top 0.254: JP1.6 8.89,16.51 7.62,17.78 7.62,21.59 U1.6
PC1
  Top 0.254: U1.5 8.89,17.78 10.16,16.51 10.16,6.35 JP1.5
PC2
  Top 0.254: JP1.8 11.43,16.51 10.16,17.78 10.16,21.59 U1.8
PC3
  Top 0.254: U1.7 11.43,17.78 12.7,16.51 12.7,6.35 JP1.7
PC4
  Top 0.254: U1.20 25.4,21.59 25.4,17.78 26.67,16.51 JP1.20
PC5
  Top 0.254: U1.19 26.67,17.78 27.94,16.51 27.94,6.35 JP1.19
PC6
  Top 0.254: U1.47 62.23,17.78 63.5,16.51 63.5,6.35 JP1.47
PC7
  Top 0.254: U1.48 60.96,21.59 60.96,17.78 62.23,16.51 JP1.48
PC8
  Top 0.254: U1.97 60.96,72.39 60.96,76.2 62.23,77.47 62.23,85.09 JP2.47
PC9
  Top 0.254: U1.96 59.69,76.2 60.96,77.47 60.96,87.63 JP2.46
PC10  (via drill 0.6)
  Top 0.254: JP2.35 46.99,77.47 45.72,76.2 45.72,72.39 U1.85 | v57.46,60.16 57.06,59.76 57.06,54.76 55.56,53.26 54.66,53.26 U2.9 | R12.2 v49.53,49.53 | v45.47,50.04 v45.47,66.55
  Bottom 0.254: 48.27,69.35 47.06,70.56 47.06,71.06 U1.85 | 48.27,69.35 v57.46,60.16 | v49.53,49.53 45.97,49.53 v45.47,50.04 | v45.47,66.55 48.26,69.34 48.27,69.35
PC11  (via drill 0.6)
  Top 0.254: JP2.36 48.26,87.63 48.26,77.47 46.99,76.2 U1.86 47.06,73.56 47.76,72.86 47.76,72.16 48.26,71.66 48.26,70.56 48.46,70.36 v48.46,67.96 | v57.96,58.46 57.56,58.06 57.56,54.56 55.56,52.56 54.66,52.56 U2.10 | U2.10 54.61,44.2 54.86,43.94 54.86,38.61 55.37,38.1 55.37,37.59 54.61,36.83 54.1,36.83 49.28,41.66 49.28,46.99 R13.2 | U2.10
  Bottom 0.254: v48.46,67.96 v57.96,58.46
PC12
  Top 0.254: JP2.33 44.45,77.47 43.18,76.2 43.18,72.39 U1.83
PC13
  Top 0.254: U1.60 13.97,76.2 15.24,77.47 15.24,87.63 JP2.10
PC14
  Top 0.254: U1.57 10.16,72.39 10.16,76.2 11.43,77.47 JP2.7
PC15
  Top 0.254: JP2.8 12.7,87.63 12.7,80.01 12.7,77.47 11.43,76.2 U1.58
PD0  (via drill 0.6)
  Top 0.254: U1.84 44.45,76.2 45.72,77.47 45.72,81.53 | 45.72,81.53 45.72,87.63 JP2.34 | v45.97,81.53 45.72,81.53 | v70.1,81.53 70.61,81.03 78.74,81.03 80.77,78.99 86.11,78.99 87.38,80.26 90.17,80.26 v90.68,80.77 | v91.19,77.47 92.2,76.45 92.2,74.17 LCD.4
  Bottom 0.254: v45.97,81.53 46.48,81.03 68.58,81.03 69.09,81.53 v70.1,81.53 | v90.68,80.77 90.68,77.98 v91.19,77.47
PD1
  Top 0.254: JP2.31 41.91,77.47 40.64,76.2 40.64,72.39 U1.81
PD2  (via drill 0.6)
  Top 0.254: U1.82 41.91,76.2 v42.16,76.45 43.18,77.47 43.18,87.63 JP2.32 | v70.1,73.91 70.87,73.91 71.12,73.66 73.66,73.66 v75.44,75.44 | v81.28,74.68 82.3,73.66 85.85,73.66 91.44,68.07 94.74,68.07 LCD.1
  Bottom 0.254: v42.16,76.45 42.67,76.96 67.06,76.96 v70.1,73.91 | v75.44,75.44 80.52,75.44 v81.28,74.68
PD3
  Top 0.254: JP2.29 39.37,77.47 38.1,76.2 38.1,72.39 U1.79
PD4  (via drill 0.6)
  Top 0.254: U1.80 39.37,76.2 40.64,77.47 40.64,79.5 | 40.64,79.5 40.64,87.63 JP2.30 | v40.89,79.5 40.64,79.5 | v70.1,79.5 78.74,79.5 80.26,77.98 86.61,77.98 87.88,79.25 92.2,79.25 LCD.8
  Bottom 0.254: v70.1,79.5 v40.89,79.5
PD5  (via drill 0.6)
  Top 0.254: 36.83,80.52 36.83,77.47 35.56,76.2 35.56,72.39 U1.77 | 36.83,80.52 JP2.27 | v37.08,80.52 36.83,80.52 | v69.34,80.52 78.49,80.52 80.52,78.49 86.36,78.49 87.63,79.76 93.47,79.76 95.25,77.98 95.25,76.96 96.52,75.69 LCD.5
  Bottom 0.254: v69.34,80.52 v37.08,80.52
PD6  (via drill 0.6)
  Top 0.254: U1.78 36.83,76.2 v38.1,77.47 38.1,87.63 JP2.28 | v70.1,76.2 70.61,76.71 75.95,76.71 77.22,75.44 80.52,75.44 82.04,76.96 85.85,76.96 v86.36,76.45
  Bottom 0.254: v38.1,77.47 68.83,77.47 v70.1,76.2 | v86.36,76.45 91.69,76.45 93.22,74.93 LCD.6
PD7  (via drill 0.6)
  Top 0.254: JP2.25 34.29,77.47 33.02,76.2 33.02,72.39 U1.75 v40.89,64.52 | v70.36,59.18 v61.72,59.18
  Bottom 0.254: v40.89,64.52 51.05,64.52 57.15,58.42 57.15,57.91 57.66,57.4 59.94,57.4 v61.72,59.18 | v70.36,59.18 73.66,59.18 77.22,62.74 85.09,62.74 93.47,71.12 94.49,71.12 95.76,72.39 LCD.3
PD8
  Top 0.254: U1.40 50.8,21.59 50.8,17.78 52.07,16.51 JP1.40
PD9
  Top 0.254: U1.39 52.07,17.78 53.34,16.51 53.34,6.35 JP1.39
PD10  (via drill 0.6)
  Top 0.254: U1.42 53.34,21.59 53.34,17.78 54.61,16.51 JP1.42 | 72.39,62.23 70.1,62.23 69.85,62.48 68.58,62.48 R23.1 | 72.39,62.23 PB2.B1 72.39,62.23 | 72.39,62.23 76.71,62.23 77.22,62.74 78.99,62.74 v81.03,60.71 | v57.15,36.83 v59.18,38.86
  Bottom 0.254: v59.18,38.86 v81.03,60.71 | v57.15,36.83 57.66,36.32 57.66,26.42 54.61,23.37 U1.42
PD11  (via drill 0.6)
  Top 0.254: JP1.41 55.88,6.35 55.88,16.51 54.61,17.78 U1.41 55.37,21.08 55.37,21.84 55.88,22.35 55.88,23.37 v58.17,25.65 | 68.58,75.18 69.85,75.18 70.1,74.93 72.39,74.93 PB1.B1 | 68.58,75.18 R22.1 68.58,75.18 | v58.17,53.85 58.17,57.4 58.93,58.17 v58.93,59.69 | v67.56,73.91 67.56,74.93 67.82,75.18 68.58,75.18
  Bottom 0.254: v58.17,53.85 v58.17,25.65 | v58.93,59.69 58.93,61.47 67.06,69.6 67.06,73.41 v67.56,73.91
PD12  (via drill 0.6)
  Top 0.254: U1.44 55.88,21.59 55.88,17.78 57.15,16.51 JP1.44 | v68.58,32.26 68.58,35.81 | 68.58,35.81 R25.1 68.58,35.81 | 68.58,35.81 69.85,35.81 70.1,35.56 72.39,35.56 PB4.B1
  Bottom 0.254: 57.15,23.37 U1.44 59.44,25.15 61.98,25.15 68.58,31.75 v68.58,32.26
PD13  (via drill 0.6)
  Top 0.254: U1.43 57.15,17.78 58.42,16.51 58.42,6.35 JP1.43 | 70.1,49.53 72.39,49.53 PB3.B1 | 70.1,49.53 69.85,49.78 68.58,49.78 R24.1 | v70.1,47.24 70.1,49.53
  Bottom 0.254: v70.1,47.24 70.1,32.51 62.23,24.64 59.69,24.64 58.42,23.37 58.42,22.35 57.15,21.08 U1.43
PD14
  Top 0.254: U1.46 58.42,21.59 58.42,17.78 59.69,16.51 JP1.46
PD15
  Top 0.254: U1.45 59.69,17.78 60.96,16.51 60.96,6.35 JP1.45
PE0
  Top 0.254: JP2.15 21.59,77.47 20.32,76.2 20.32,72.39 U1.65
PE1
  Top 0.254: U1.66 21.59,76.2 22.86,77.47 22.86,87.63 JP2.16
PE2
  Top 0.254: JP2.13 19.05,77.47 17.78,76.2 17.78,72.39 U1.63
PE3
  Top 0.254: U1.64 19.05,76.2 20.32,77.47 20.32,87.63 JP2.14
PE4
  Top 0.254: JP2.11 16.51,77.47 15.24,76.2 15.24,72.39 U1.61
PE5
  Top 0.254: U1.62 16.51,76.2 17.78,77.47 17.78,87.63 JP2.12
PE6
  Top 0.254: U1.59 12.7,72.39 12.7,76.2 13.97,77.47 JP2.9
PE7
  Top 0.254: U1.23 31.75,17.78 33.02,16.51 33.02,6.35 JP1.23
PE8
  Top 0.254: U1.26 33.02,21.59 33.02,17.78 34.29,16.51 JP1.26
PE9  (via drill 0.6)
  Top 0.254: U1.25 34.29,17.78 35.56,16.51 35.56,6.35 JP1.25 | v50.8,57.15 53.34,57.15 54.61,57.15 U2.3 | v50.55,63.5 49.28,64.77 R6.1
  Bottom 0.254: U1.25 35.56,21.59 35.56,24.13 36.83,25.4 39.88,25.4 50.8,36.32 50.8,36.83 v50.8,57.15 50.8,62.74 50.8,62.99 v50.55,63.5
PE10
  Top 0.254: U1.28 35.56,21.59 35.56,17.78 36.83,16.51 JP1.28
PE11  (via drill 0.6)
  Top 0.254: U1.27 36.83,17.78 38.1,16.51 38.1,6.35 JP1.27 | 51.96,45.96 51.96,45.97 | 51.96,45.97 51.96,49.96 51.46,50.46 51.46,54.46 52.86,55.86 | 52.86,55.86 53.46,56.46 54.46,56.46 U2.4 | v52.58,56.13 52.83,55.88 52.86,55.86 | v51.82,58.93 49.28,61.47 49.28,62.23 R7.1 | v52.07,45.72 52.07,45.97 51.96,45.97
  Bottom 0.254: v52.07,45.72 52.07,36.83 40.13,24.89 38.1,24.89 38.1,21.59 U1.27 | v52.58,56.13 52.58,58.17 v51.82,58.93
PE12
  Top 0.254: U1.30 38.1,21.59 38.1,17.78 39.37,16.51 JP1.30
PE13  (via drill 0.6)
  Top 0.254: U1.29 39.37,17.78 40.64,16.51 40.64,6.35 JP1.29 | v53.46,43.46 53.46,44.7 | 53.46,44.7 53.46,47.26 53.46,47.36 52.46,48.36 52.46,50.16 51.96,50.66 51.96,54.26 53.56,55.86 54.56,55.86 U2.5 | R8.1 v49.28,59.69 | v53.09,44.7 53.34,44.7 53.46,44.7 | v55.88,41.91 55.37,41.4 55.37,38.86 55.88,38.35 55.88,37.34 54.86,36.32 53.85,36.32 48.77,41.4 48.77,44.7 v48.26,45.21 | v43.43,59.44 v43.43,50.04
  Bottom 0.254: 40.56,24.1 40.66,24.2 | 40.56,24.1 40.56,23.5 40.66,23.4 40.66,22.3 39.46,21.1 39.46,20.4 U1.29 | v53.46,43.46 53.36,43.36 53.36,43.26 52.56,42.46 52.56,36.66 52.58,36.58 40.64,24.64 40.64,24.13 40.56,24.1 | v49.28,59.69 43.69,59.69 v43.43,59.44 | v55.88,41.91 v53.09,44.7 | v43.43,50.04 v48.26,45.21
PE14  (via drill 0.6)
  Top 0.254: U1.32 40.64,21.59 40.64,17.78 41.91,16.51 JP1.32 | v54.36,37.76 54.36,42.42 | 54.36,42.42 54.36,43.76 53.96,44.16 53.96,47.56 52.96,48.56 52.96,50.36 52.46,50.86 52.46,54.06 53.56,55.16 54.56,55.16 U2.6 | 54.36,42.42 53.34,42.42 50.8,44.96 50.8,54.86 49.28,56.39 49.28,57.15 R9.1
  Bottom 0.254: 41.86,22.9 U1.32 41.15,23.62 41.15,24.38 54.36,37.59 v54.36,37.76
PE15
  Top 0.254: U1.31 41.91,17.78 43.18,16.51 43.18,6.35 JP1.31
PF0
  Top 0.254: U1.55 7.62,72.39 7.62,76.2 8.89,77.47 JP2.5
PF1
  Top 0.254: JP2.6 10.16,87.63 10.16,77.47 8.89,76.2 U1.56
PF2
  Top 0.254: U1.10 12.7,21.59 12.7,17.78 13.97,16.51 JP1.10
PF4
  Top 0.254: U1.13 19.05,17.78 20.32,16.51 20.32,6.35 JP1.13
PF6
  Top 0.254: JP2.39 52.07,77.47 50.8,76.2 50.8,72.39 U1.89
PF9
  Top 0.254: U1.53 5.08,72.39 5.08,76.2 6.35,77.47 6.35,80.01 6.35,83.82 6.35,85.09 JP2.3
PF10
  Top 0.254: U1.54 6.35,76.2 7.62,77.47 7.62,87.63 JP2.4
REF  (via drill 0.6)
  Top 0.254: 81.79,16.51 86.36,11.94 88.39,11.94 REF_SEL.2 | 81.79,16.51 81.53,16.76 81.53,17.27 U3.6 | v74.68,18.54 73.91,17.78 73.91,17.53 U4.6 | 81.79,16.51 v81.28,16
  Bottom 0.254: v74.68,18.54 78.74,18.54 v81.28,16
REF_EXT
  Top 0.254: REF_SEL.3 92.71,7.62 EXT_REF.2
VDD
  Top 0.254: U1.70 26.67,76.2 27.94,77.47 27.94,87.63 JP2.20
VDD_B  (via drill 0.6)
  Top 0.254: U2.19 60.26,57.86 60.26,58.36 U2.20 60.36,58.36 60.36,58.46 60.26,58.56 60.26,59.46 60.26,59.56 59.76,60.06 59.76,61.26 R5.1 59.86,61.26 62.16,61.26 C3.1 62.23,61.21 63.5,61.21 68.33,66.04 72.14,66.04 76.2,70.1 v79.25,70.1 | LVL_EN.2 96.52,87.88 v90.68,82.04
  Bottom 0.254: v90.68,82.04 79.25,70.61 v79.25,70.1

### Text on the board
tPlace: 1 | GND | EXT